# EasyEDA schematic SCH_Relatorio2-ProjRoboticos_2026-09-19.json
TITLE: Sheet_1; REV: 1.0; Date: 2026-09-19; Sheet: 1/1; Drawn By: educorreia; Company: Your Company
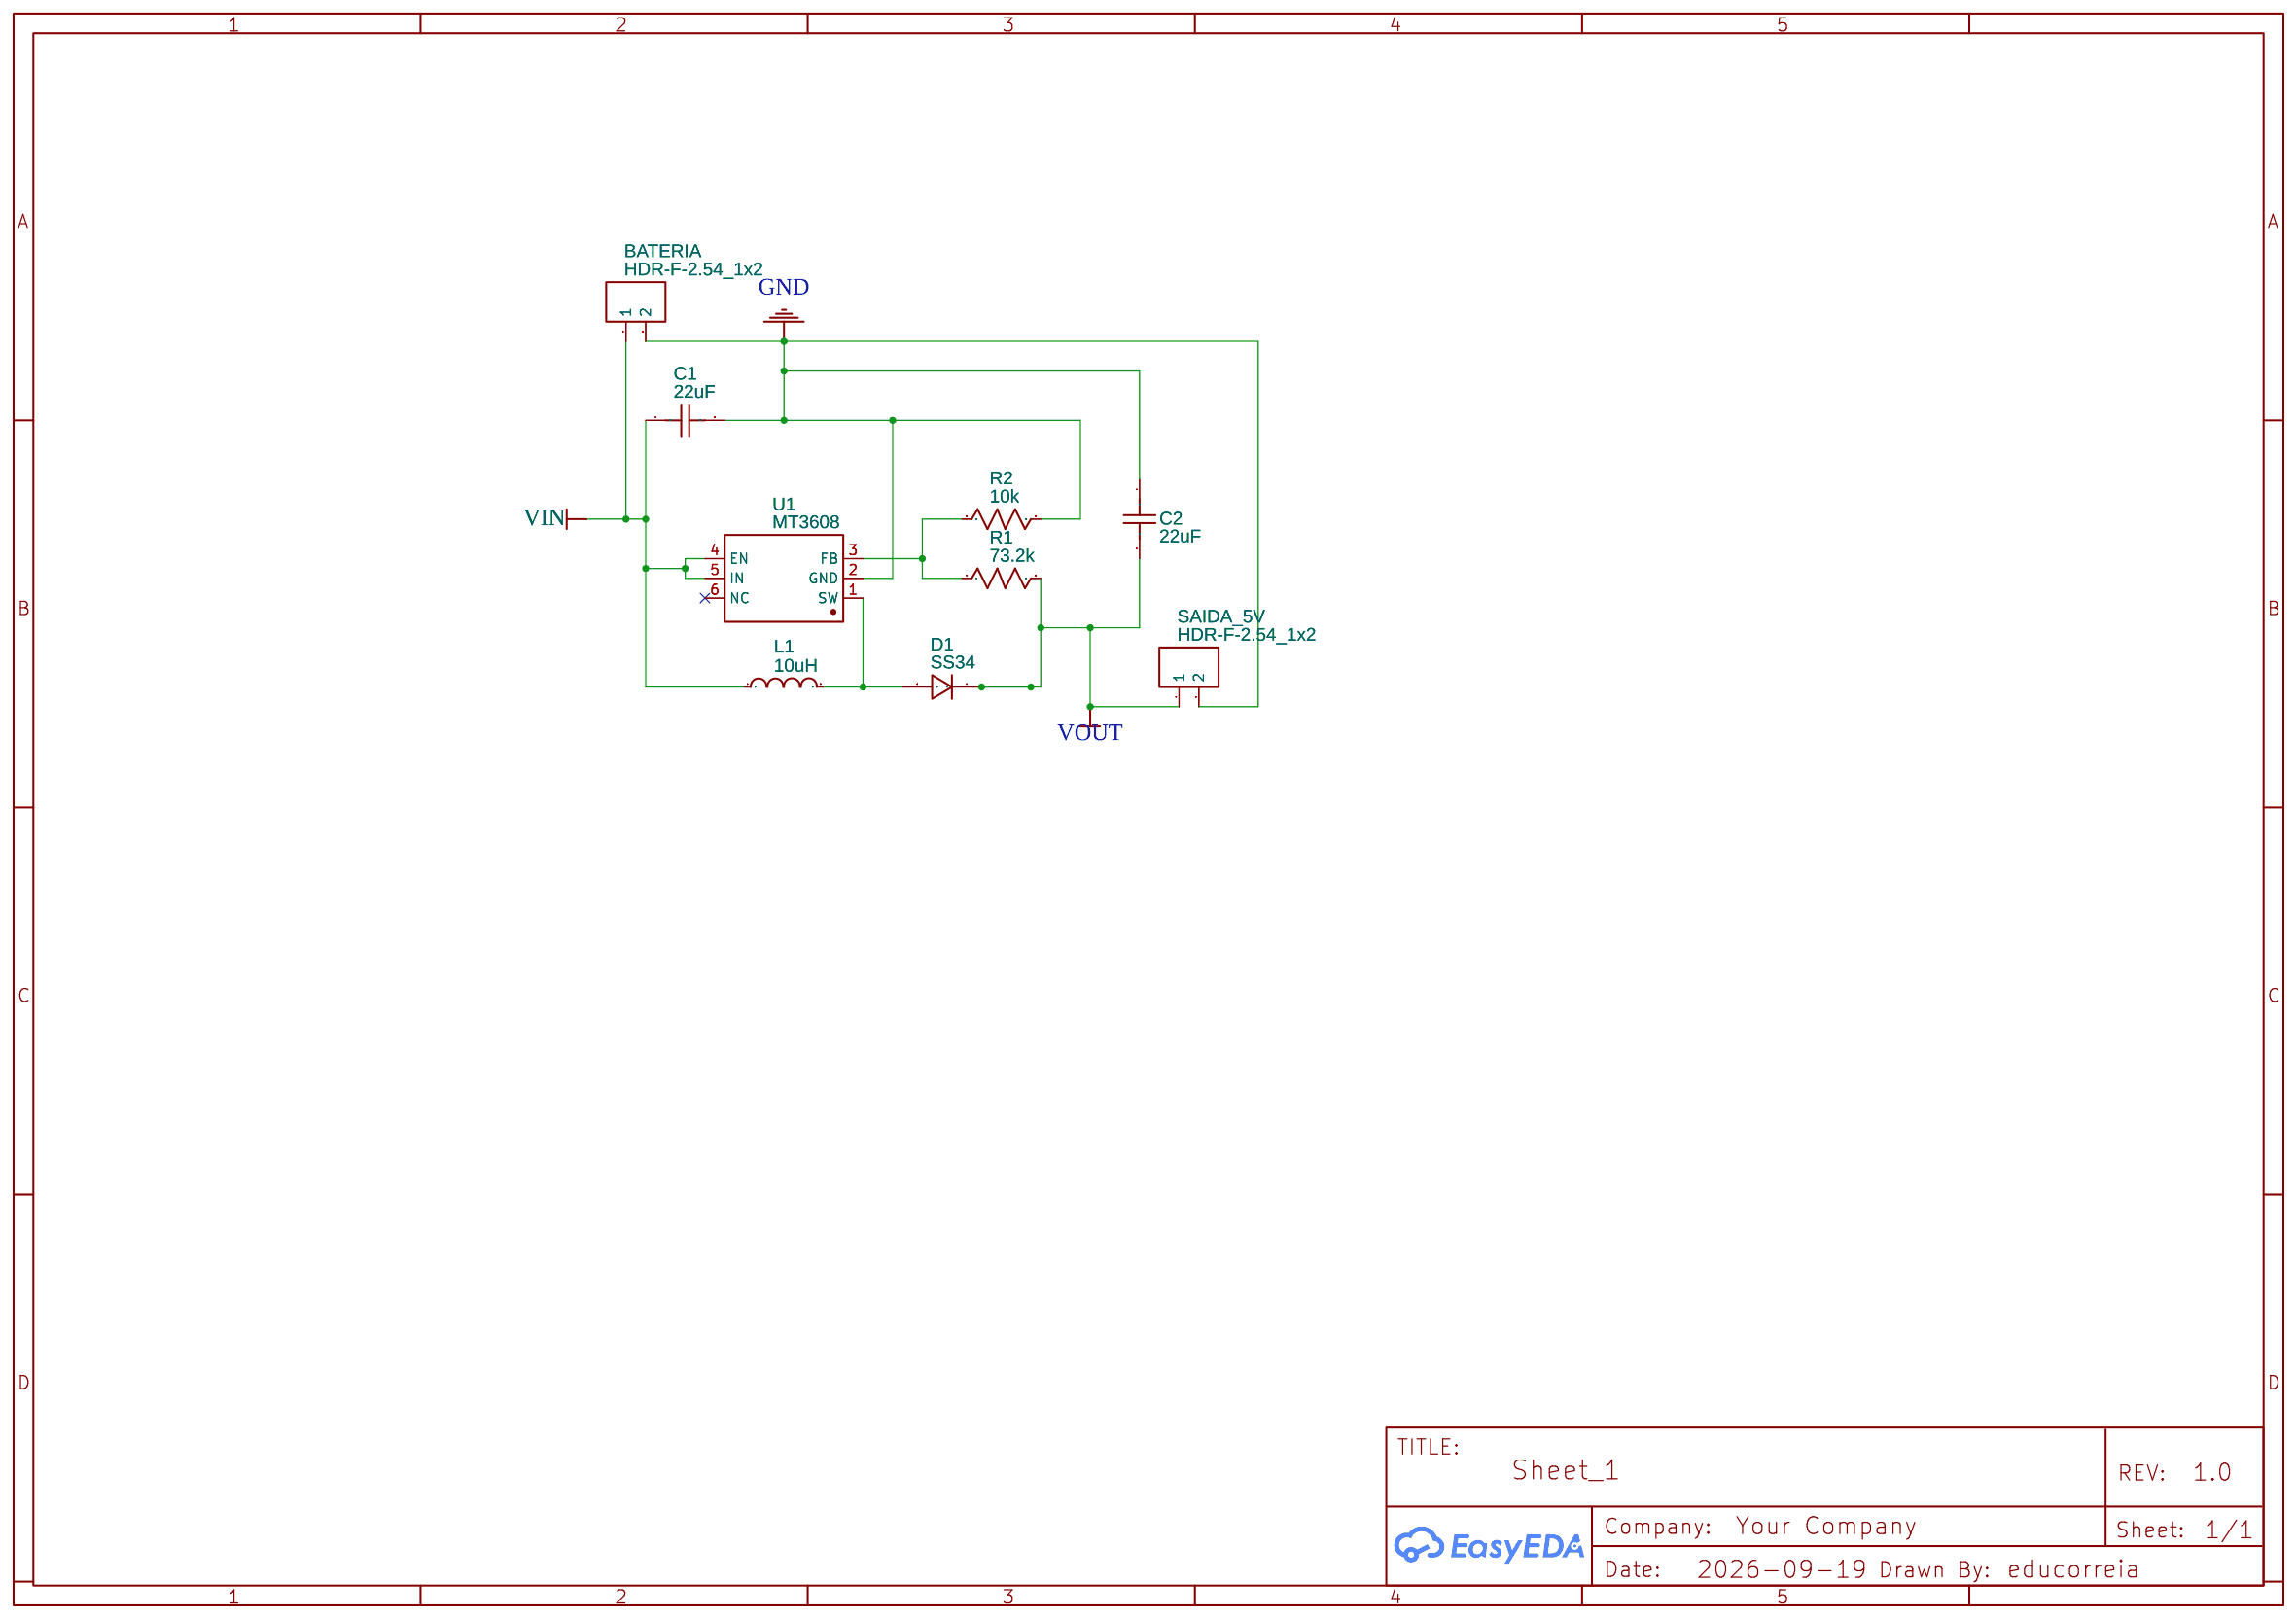
[diagram p0: schematic sheet]

## Parts
BATERIA  HDR-F-2.54_1x2  [HDR-F-2.54_1X2]
C1  22uF  [C1206]
C2  22uF  [C1206]
D1  SS34  [DO-214AC_L4.3-W2.7-LS5.2-RD]
L1  10uH  [IND-SMD_L7.8-W7.0_GCD75]
R1  73.2k  [R0603]
R2  10k  [R0603]
SAIDA_5V  HDR-F-2.54_1x2  [HDR-F-2.54_1X2]
U1  MT3608  [SOT-23-6_L2.9-W1.6-P0.95-LS2.8-BL]

## Library data of the parts
BATERIA SAIDA_5V = HDR-F-2.54_1x2: Supplier Part: C49661; Supplier: LCSC; Contributor: LCEDA_Lib
C1 C2 = C_0603_US: Contributor: LCEDA_Lib
D1 = 1N4007W: Supplier: LCSC; Supplier Part: C328592; Manufacturer: BLUE ROCKET; Contributor: LCEDA_Lib
L1 = L0603_US: Contributor: LCEDA_Lib
R1 R2 = R_0603_US: Contributor: LCEDA_Lib
U1 = MT3608: Supplier: LCSC; Manufacturer: 西安航天民芯; Supplier Part: C84817; JLCPCB Part Class: Extended Part

## Nets
GND: BATERIA.2 C1.2 C2.1 R2.2 SAIDA_5V.2 U1.2(GND)
VIN: BATERIA.1 C1.1 L1.1 U1.4(EN) U1.5(IN)
VOUT: C2.2 D1.1 R1.2 SAIDA_5V.1
Net-(D1-2): D1.2 L1.2 U1.1(SW)
Net-(R1-1): R1.1 R2.1 U1.3(FB)

Not connected (* = marked no-connect by the designer): U1 6(NC)*
